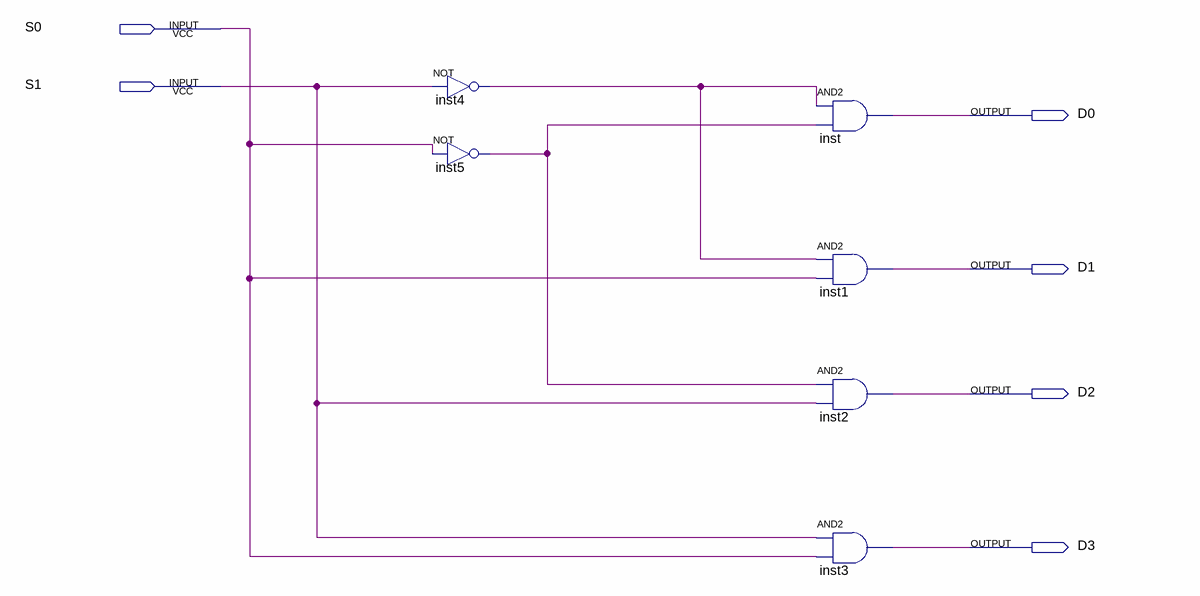
[diagram p0: schematic sheet]
// Quartus schematic decoder2x4.bdf as structural Verilog: 6 symbols, 6 pins
module decoder2x4 (
  input  S0,
  input  S1,
  output D0,
  output D1,
  output D2,
  output D3
);

  wire inst4_out, inst5_out;

  not inst4 (inst4_out, S1);
  not inst5 (inst5_out, S0);
  and inst (D0, inst4_out, inst5_out);
  and inst1 (D1, inst4_out, S0);
  and inst2 (D2, inst5_out, S1);
  and inst3 (D3, S1, S0);
endmodule
